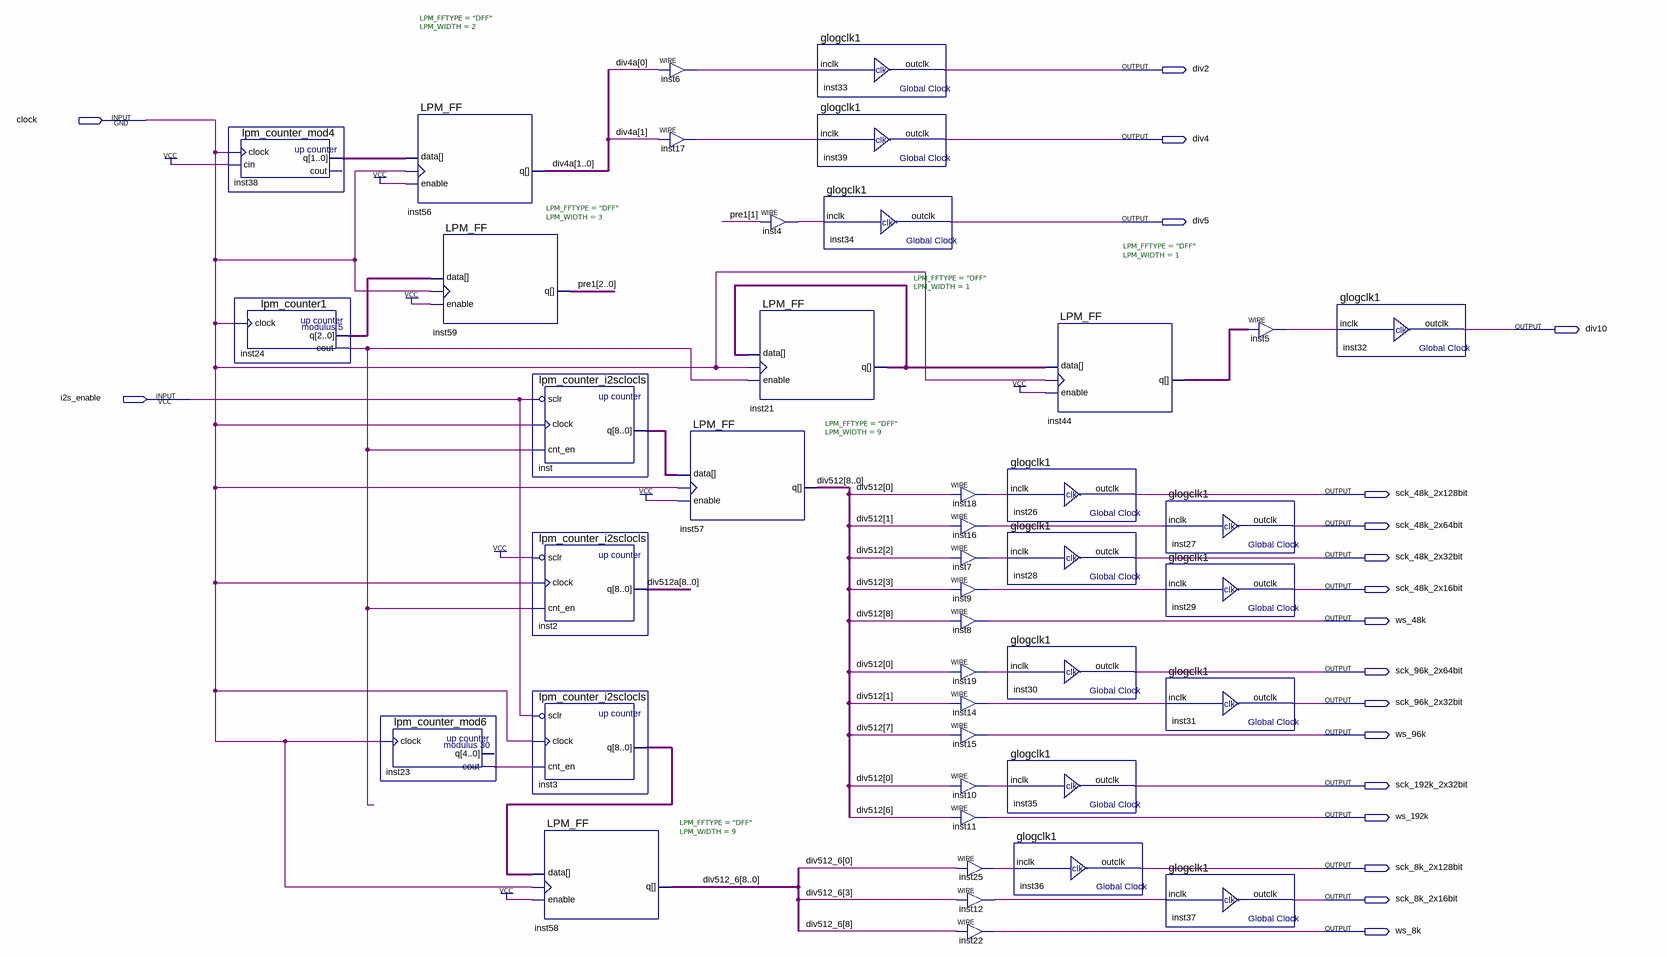
[diagram p0: schematic sheet]
// Quartus schematic i2smclk.bdf as structural Verilog: 42 symbols, 19 pins
module i2smclk (
  input  clock,
  input  i2s_enable,
  output div2,
  output div4,
  output div5,
  output div10,
  output sck_48k_2x128bit,
  output sck_48k_2x64bit,
  output sck_48k_2x32bit,
  output sck_48k_2x16bit,
  output ws_48k,
  output sck_96k_2x64bit,
  output sck_96k_2x32bit,
  output ws_96k,
  output sck_192k_2x32bit,
  output ws_192k,
  output sck_8k_2x128bit,
  output sck_8k_2x16bit,
  output ws_8k
);

  wire inst4_out, inst5_out, inst6_out, inst7_out, inst9_out, inst10_out, inst12_out, inst14_out, inst16_out,
       inst17_out, inst18_out, inst19_out, inst21_q, inst23_cout, inst24_cout, inst25_out, inst44_q;
  wire [1:0] div4a, inst38_q;
  wire [2:0] inst24_q, pre1;
  wire [8:0] div512, div512_6, div512a, inst3_q, inst_q;

  lpm_counter_mod4 inst38 (.clock(clock), .cin(1'b1), .q(inst38_q));  // open: cout
  lpm_counter1 inst24 (.clock(clock), .cout(inst24_cout), .q(inst24_q));
  lpm_counter_mod6 inst23 (.clock(clock), .cout(inst23_cout));  // open: q
  LPM_FF #(.LPM_FFTYPE("DFF"), .LPM_WIDTH(2)) inst56 (.enable(1'b1), .clock(clock), .data(inst38_q), .q(div4a));
  LPM_FF #(.LPM_FFTYPE("DFF"), .LPM_WIDTH(3)) inst59 (.enable(1'b1), .clock(clock), .data(inst24_q), .q(pre1));
  lpm_counter_i2sclocls inst (.clock(clock), .cnt_en(inst24_cout), .sclr(~i2s_enable), .q(inst_q));
  lpm_counter_i2sclocls inst2 (.clock(clock), .cnt_en(inst24_cout), .sclr(~1'b1), .q(div512a));
  lpm_counter_i2sclocls inst3 (.clock(clock), .cnt_en(inst23_cout), .sclr(~i2s_enable), .q(inst3_q));
  LPM_FF #(.LPM_FFTYPE("DFF"), .LPM_WIDTH(9)) inst58 (.enable(1'b1), .clock(clock), .data(inst3_q), .q(div512_6));
  assign inst6_out = div4a[0];  // WIRE inst6
  assign inst17_out = div4a[1];  // WIRE inst17
  LPM_FF #(.LPM_FFTYPE("DFF"), .LPM_WIDTH(9)) inst57 (.enable(1'b1), .clock(clock), .data(inst_q), .q(div512));
  LPM_FF #(.LPM_FFTYPE("DFF"), .LPM_WIDTH(1)) inst21 (
    .clock(clock), .data(inst21_q), .enable(inst24_cout), .q(inst21_q));
  assign inst4_out = pre1[1];  // WIRE inst4
  glogclk1 inst33 (.inclk(inst6_out), .outclk(div2));
  glogclk1 inst39 (.inclk(inst17_out), .outclk(div4));
  glogclk1 inst34 (.inclk(inst4_out), .outclk(div5));
  assign inst18_out = div512[0];  // WIRE inst18
  assign inst16_out = div512[1];  // WIRE inst16
  assign inst7_out = div512[2];  // WIRE inst7
  assign inst9_out = div512[3];  // WIRE inst9
  assign ws_48k = div512[8];  // WIRE inst8
  assign inst19_out = div512[0];  // WIRE inst19
  assign inst14_out = div512[1];  // WIRE inst14
  assign ws_96k = div512[7];  // WIRE inst15
  assign inst10_out = div512[0];  // WIRE inst10
  assign ws_192k = div512[6];  // WIRE inst11
  assign inst25_out = div512_6[0];  // WIRE inst25
  assign inst12_out = div512_6[3];  // WIRE inst12
  assign ws_8k = div512_6[8];  // WIRE inst22
  LPM_FF #(.LPM_FFTYPE("DFF"), .LPM_WIDTH(1)) inst44 (.clock(clock), .data(inst21_q), .enable(1'b1), .q(inst44_q));
  glogclk1 inst26 (.inclk(inst18_out), .outclk(sck_48k_2x128bit));
  glogclk1 inst28 (.inclk(inst7_out), .outclk(sck_48k_2x32bit));
  glogclk1 inst30 (.inclk(inst19_out), .outclk(sck_96k_2x64bit));
  glogclk1 inst35 (.inclk(inst10_out), .outclk(sck_192k_2x32bit));
  glogclk1 inst36 (.inclk(inst25_out), .outclk(sck_8k_2x128bit));
  glogclk1 inst27 (.inclk(inst16_out), .outclk(sck_48k_2x64bit));
  glogclk1 inst29 (.inclk(inst9_out), .outclk(sck_48k_2x16bit));
  glogclk1 inst31 (.inclk(inst14_out), .outclk(sck_96k_2x32bit));
  glogclk1 inst37 (.inclk(inst12_out), .outclk(sck_8k_2x16bit));
  assign inst5_out = inst44_q;  // WIRE inst5
  glogclk1 inst32 (.inclk(inst5_out), .outclk(div10));
endmodule
